# Altium schematic sheet Power.SchDoc
size A4
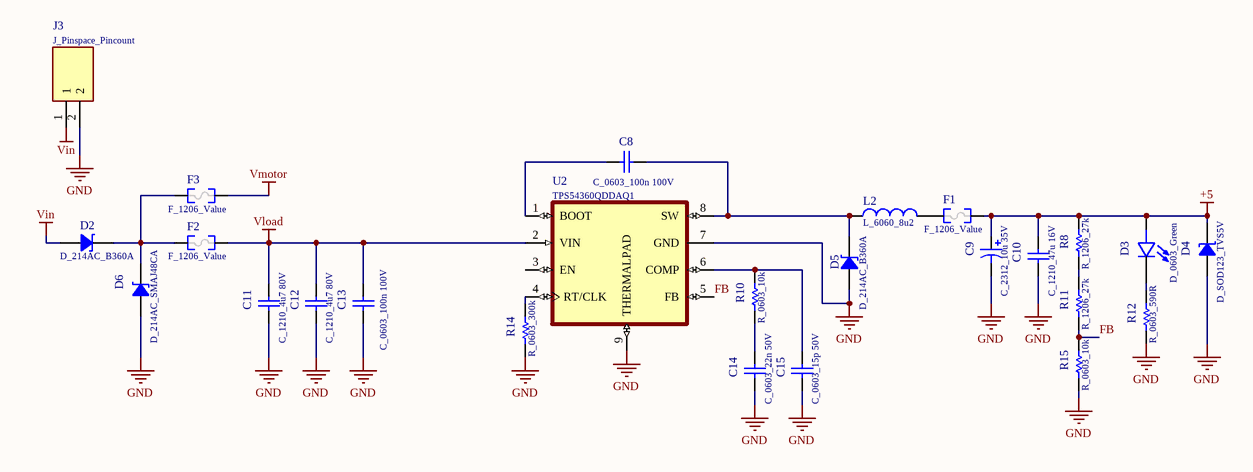
[diagram p0: Power.SchDoc]

## Parts
C8  C_0603_100n 100V  [CAP 0603]
C9  C_2312_10u 35V  [CAP 2312 TAN]
C10  C_1210_47u 16V  [CAP 1210]
C11  C_1210_4u7 80V  [CAP 1210]
C12  C_1210_4u7 80V  [CAP 1210]
C13  C_0603_100n 100V  [CAP 0603]
C14  C_0603_22n 50V  [CAP 0603]
C15  C_0603_15p 50V  [CAP 0603]
D2  D_214AC_B360A  [DO214AC SMA]
D3  D_0603_Green  [Led 0603]
D4  D_SOD123_TVS5V  [SOD-123]
D5  D_214AC_B360A  [DO214AC SMA]
D6  D_214AC_SMAJ48CA  [DO214AC SMA]
F1  F_1206_Value  [FUSE 1206_3216 0.6MM]
F2  F_1206_Value  [FUSE 1206_3216 0.6MM]
F3  F_1206_Value  [FUSE 1206_3216 0.6MM]
J3  J_Pinspace_Pincount  [2 Pin PCB STB 5.08]
L2  L_6060_8u2  [Inductor 6060]
R8  R_1206_27k  [RES 1206]
R10  R_0603_10k  [RES 0603]
R11  R_1206_27k  [RES 1206]
R12  R_0603_590R  [RES 0603]
R14  R_0603_300k  [RES 0603]
R15  R_0603_10k  [RES 1206]
U2  TPS54360QDDAQ1  [SOIC8]

## Nets
+5: C9.1 C10.1 D3.1(A) D4.2 F1.2 R8.2
GND: C9.2 C10.2 C11.2 C12.2 C13.2 C14.2 C15.2 D4.1 D5.1 D6.1 J3.2 R12.1 R14.1 R15.1 U2.7(GND) U2.9(THERMALPAD)
Vin: D2.1 J3.1
Vload: C11.1 C12.1 C13.1 F2.2 U2.2(VIN)
Vmotor: F3.2
FB: R11.1 R15.2 U2.5(FB)
NetC8_1: C8.1 D5.2 L2.1 U2.8(SW)
NetC8_2: C8.2 U2.1(BOOT)
NetC14_1: C14.1 R10.1
NetC15_1: C15.1 R10.2 U2.6(COMP)
NetD2_2: D2.2 D6.2 F2.1 F3.1
NetD3_2: D3.2(C) R12.2
NetF1_1: F1.1 L2.2
NetR8_1: R8.1 R11.2
NetR14_2: R14.2 U2.4(RT/CLK)

Not connected (* = marked no-connect by the designer): U2 3(EN)

## Library data of the parts
C8 C10-C15 = Cap: Capacitor; Published: 8-Jun-2000; LatestRevisionDate: 17-Jul-2002; LatestRevisionNote: Re-released for DXP Platform.; Publisher: Altium Limited
C9 = Cap Tantalium: Capacitor Tantalium; Published: 8-Jun-2000; LatestRevisionDate: 17-Jul-2002; LatestRevisionNote: Re-released for DXP Platform.; Publisher: Altium Limited
D2 D5 D6 = Diode Zener: Zener Diode
D3 = Led: MP: SML-D12FWT86; MF: Rohm; Price: None; Availability: In Stock; Package: 0603 Rohm; SnapEDA_Link: https://www.snapeda.com/parts/SML-D12FWT86/Rohm/view-part/?ref=snap; Check_prices: https://www.snapeda.com/parts/SML-D12FWT86/Rohm/view-part/?ref=eda; Value: *; Purchase-URL: https://pricing.snapeda.com/search/part/SML-D12FWT86/?ref=eda
D4 = DIODE TVS UNI: Rectifier Diode
F1-F3 = Fuse
J3 = 2 Pin PCB Terminal Block: MF: CUI Devices; MP: TBP02R1-381-02BE; CUI_purchase_URL: https://www.cuidevices.com/product/interconnect/connectors/terminal-blocks/tbp02r1-381-series?utm_source=snapeda.com&utm_medium=referral&utm_campaign=snapedaBOM; Purchase-URL: https://pricing.snapeda.com/search/part/TBP02R1-381-02BE/?ref=eda; Price: None; SnapEDA_Link: https://www.snapeda.com/parts/TBP02R1-381-02BE/CUI+Devices/view-part/?ref=snap; Check_prices: https://www.snapeda.com/parts/TBP02R1-381-02BE/CUI+Devices/view-part/?ref=eda; Package: None; Availability: In Stock; Value: *
L2 = Inductor: PCB_Layout: Complies with manufacturer's recommendation.; Published: 26-Sep-2008; DatasheetVersion: Mar-2008; PackageVersion: Mar-2008; PackageReference: B82462G4; Publisher: Altium Limited; PackageDescription: SM Power Inductor; 2 Leads; Body 6.3 x 6.3 x 3.0 mm (LxWxH); ComponentLink1Description: Manufacturer Link; ComponentLink1URL: http://www.epcos.com/; ComponentLink2Description: Datasheet; ComponentLink2URL: http://www.epcos.com/inf/30/db/ind_2008/b82462g4.pdf
R8 R10-R12 R14 R15 = Res: Resistor; Published: 8-Jun-2000; LatestRevisionDate: 17-Jul-2002; LatestRevisionNote: Re-released for DXP Platform.; Publisher: Altium Limited
U2 = TPS54360QDDAQ1: Package: None; Price: None; Value: *; MP: TPS54360QDDAQ1; Availability: Unavailable